# Altium schematic sheet alim.SchDoc: Alimentation
size A4; ApprovedBy: Bertil RANDONNET; CheckedBy: Manelle TAHIRI; Author: Assil MAHFOUDI; DrawnBy: Assil MAHFOUDI; Engineer: Assil MAHFOUDI; Revision: V1.0 REV A; SheetNumber: 5; SheetTotal: 6
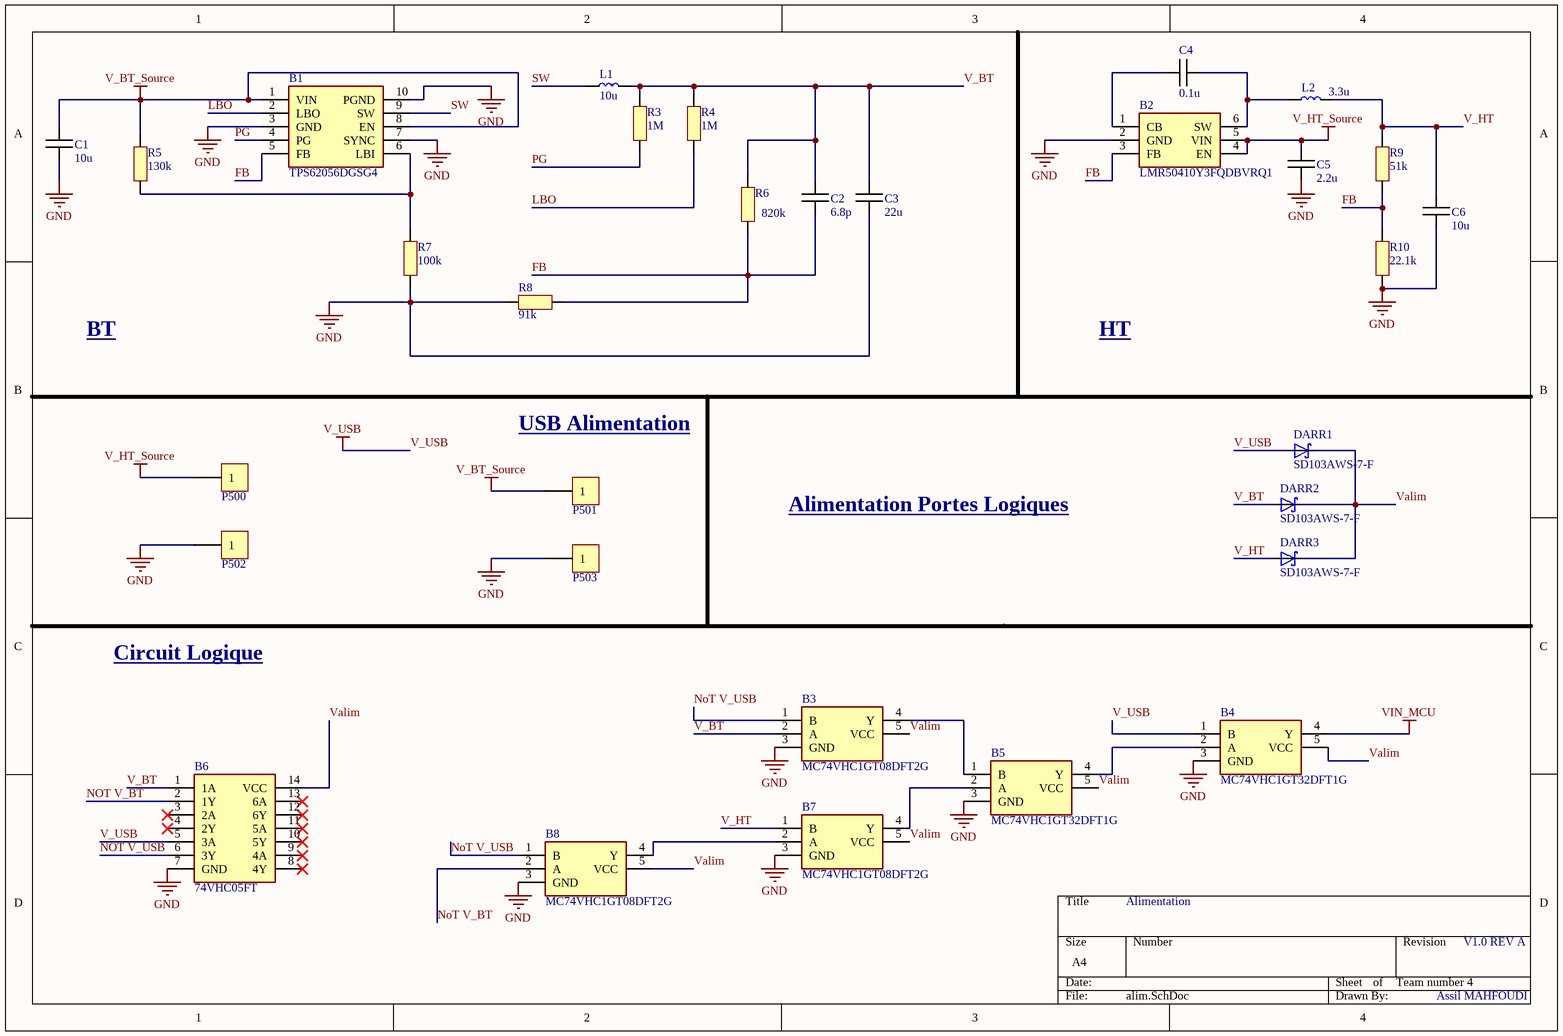
[diagram p0: alim.SchDoc]

## Parts
B1  TPS62056DGSG4  [SOP50P490X110-10N]
B2  LMR50410Y3FQDBVRQ1  [SOT95P280X145-6N]
B3  MC74VHC1GT08DFT2G  [SOT65P210X110-5N]
B4  MC74VHC1GT32DFT1G  [SOT65P210X110-5N]
B5  MC74VHC1GT32DFT1G  [SOT65P210X110-5N]
B6  74VHC05FT  [SOP65P640X120-14N]
B7  MC74VHC1GT08DFT2G  [SOT65P210X110-5N]
B8  MC74VHC1GT08DFT2G  [SOT65P210X110-5N]
C1  10u  [CAPC1005X06N]
C2  6.8p  [CAPC1005X06N]
C3  22u  [CAPC1005X06N]
C4  0.1u  [CAPC1005X06N]
C5  2.2u  [CAPC1005X06N]
C6  10u  [CAPC1005X06N]
DARR1  SD103AWS-7-F  [SD103AWS-7-F]
DARR2  SD103AWS-7-F  [SD103AWS-7-F]
DARR3  SD103AWS-7-F  [SD103AWS-7-F]
L1  10u  [LQPC1005X06N]
L2  3.3u  [LQPC1005X06N]
P500  Plage CMS 10x5  [Plage CMS 10x5]  (value not drawn)  (no BOM)
P501  Plage CMS 10x5  [Plage CMS 10x5]  (value not drawn)  (no BOM)
P502  Plage CMS 10x5  [Plage CMS 10x5]  (value not drawn)  (no BOM)
P503  Plage CMS 10x5  [Plage CMS 10x5]  (value not drawn)  (no BOM)
R3  1M  [RESC1005X06N]
R4  1M  [RESC1005X06N]
R5  130k  [RESC1005X06N]
R6  820k  [RESC1005X06N]
R7  100k  [RESC1005X06N]
R8  91k  [RESC1005X06N]
R9  51k  [RESC1005X06N]
R10  22.1k  [RESC1005X06N]

## Nets
GND: B1.3(GND) B1.7(SYNC) B1.10(PGND) B2.2(GND) B3.3(GND) B4.3(GND) B5.3(GND) B6.7(GND) B7.3(GND) B8.3(GND) C1.1 C3.2 C5.2 C6.1 P502.1 P503.1 R7.1 R8.1 R10.1
V_BT_Source: B1.1(VIN) B1.8(EN) C1.2 P501.1 R5.2
V_HT_Source: B2.4(EN) B2.5(VIN) C5.1 P500.1
V_USB: B4.1(B) B6.5(3A) DARR1.2(A)
VIN_MCU: B4.4(Y)
FB: B1.5(FB) B2.3(FB) C2.1 R6.1 R8.2 R9.1 R10.2
LBO: B1.2(LBO) R4.1
NOT V_BT: B6.2(1Y) B8.2(A)
NOT V_USB: B3.1(B) B6.6(3Y) B8.1(B)
PG: B1.4(PG) R3.1
SW: B1.9(SW) L1.1
V_BT: B3.2(A) B6.1(1A) C2.2 C3.1 DARR2.2(A) L1.2 R3.2 R4.2 R6.2
V_HT: B7.1(B) C6.2 DARR3.2(A) L2.2 R9.2
Valim: B3.5(VCC) B4.5(VCC) B5.5(VCC) B6.14(VCC) B7.5(VCC) B8.5(VCC) DARR1.1(C) DARR2.1(C) DARR3.1(C)
NetB1_6: B1.6(LBI) R5.1 R7.2
NetB2_1: B2.1(CB) C4.2
NetB2_6: B2.6(SW) C4.1 L2.1
NetB3_4: B3.4(Y) B5.1(B)
NetB4_2: B4.2(A) B5.4(Y)
NetB5_2: B5.2(A) B7.4(Y)
NetB7_2: B7.2(A) B8.4(Y)

Not connected (* = marked no-connect by the designer): B6 3(2A)* 4(2Y)* 8(4Y)* 9(4A)* 10(5Y)* 11(5A)* 12(6Y)* 13(6A)*

## Notes on the sheet
- BT
- HT
- USB Alimentation
- Alimentation Portes Logiques
- Circuit Logique
- Team number 4

## Library data of the parts
B1 = TPS62056DGSG4: TEXAS INSTRUMENTS - TPS62056DGSG4 - Synchronous Buck (Step Down) Switching Regulator, Fixed, 2.7V-10Vin, 3.3V/0.8A out, 850kHz, VSSOP-10; Manufacturer_Name: Texas Instruments; Manufacturer_Part_Number: TPS62056DGSG4; Mouser Part Number: 595-TPS62056DGSG4
B2 = LMR50410Y3FQDBVRQ1: Régulateurs de tension de commutation Automotive qualified SIMPLE SWITCHER 4-V to 36-V, 1-A synchronous step-down converter 6-SOT-23 -40 to 150; Manufacturer_Name: Texas Instruments; Manufacturer_Part_Number: LMR50410Y3FQDBVRQ1; Mouser Part Number: 595-R50410Y3FQDBVRQ1
B3 B7 B8 = MC74VHC1GT08DFT2G: Single 2-Input AND Gate, TTL Level; Manufacturer_Name: onsemi; Manufacturer_Part_Number: MC74VHC1GT08DFT2G; Parameter 3: *
B4 B5 = MC74VHC1GT32DFT1G: Single 2-Input OR Gate, TTL Level; Manufacturer_Name: onsemi; Manufacturer_Part_Number: MC74VHC1GT32DFT1G; Mouser Part Number: 863-C74VHC1GT32DFT1G
B6 = 74VHC05FT: Logic Gates CMOS LOGIC IC INVERTER; Manufacturer_Name: Toshiba; Manufacturer_Part_Number: 74VHC05FT; Mouser Part Number: 757-74VHC05FT
C1-C6 = Capacitor
DARR1-DARR3 = SD103AWS-7-F: Diode Array 3 Independent Schottky 40V 175mA Surface Mount 6-TSSOP, SC-88, SOT-363
L1 L2 = Bobine
P500-P503 = Plage CMS 10x5: Plage de report CMS 10x5mm; PN: L30; Value: Plage CMS 10x5; Footprint_statut: ok
R3-R10 = Resistor